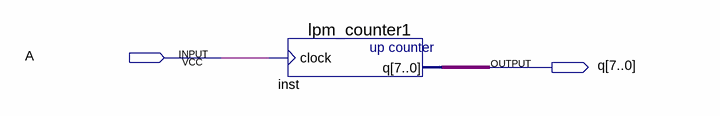
[diagram p0: schematic sheet]
// Quartus schematic counter.bdf as structural Verilog: 1 symbols, 2 pins
module counter (
  input  A,
  output [7:0] q
);

  lpm_counter1 inst (.clock(A), .q(q));
endmodule
